# EasyEDA Pro project NUEVO board Rev. B.epro, schematic StepperDrive
Board Name: StepperDrive; Create Date: 2025-12-17; Page Name: P1; Project Name: 162 Carrier Board; Schematic Name: StepperDrive; Update Date: 2025-12-16; Company: EasyEDA.com; Page Size: A4; Version: V1.0
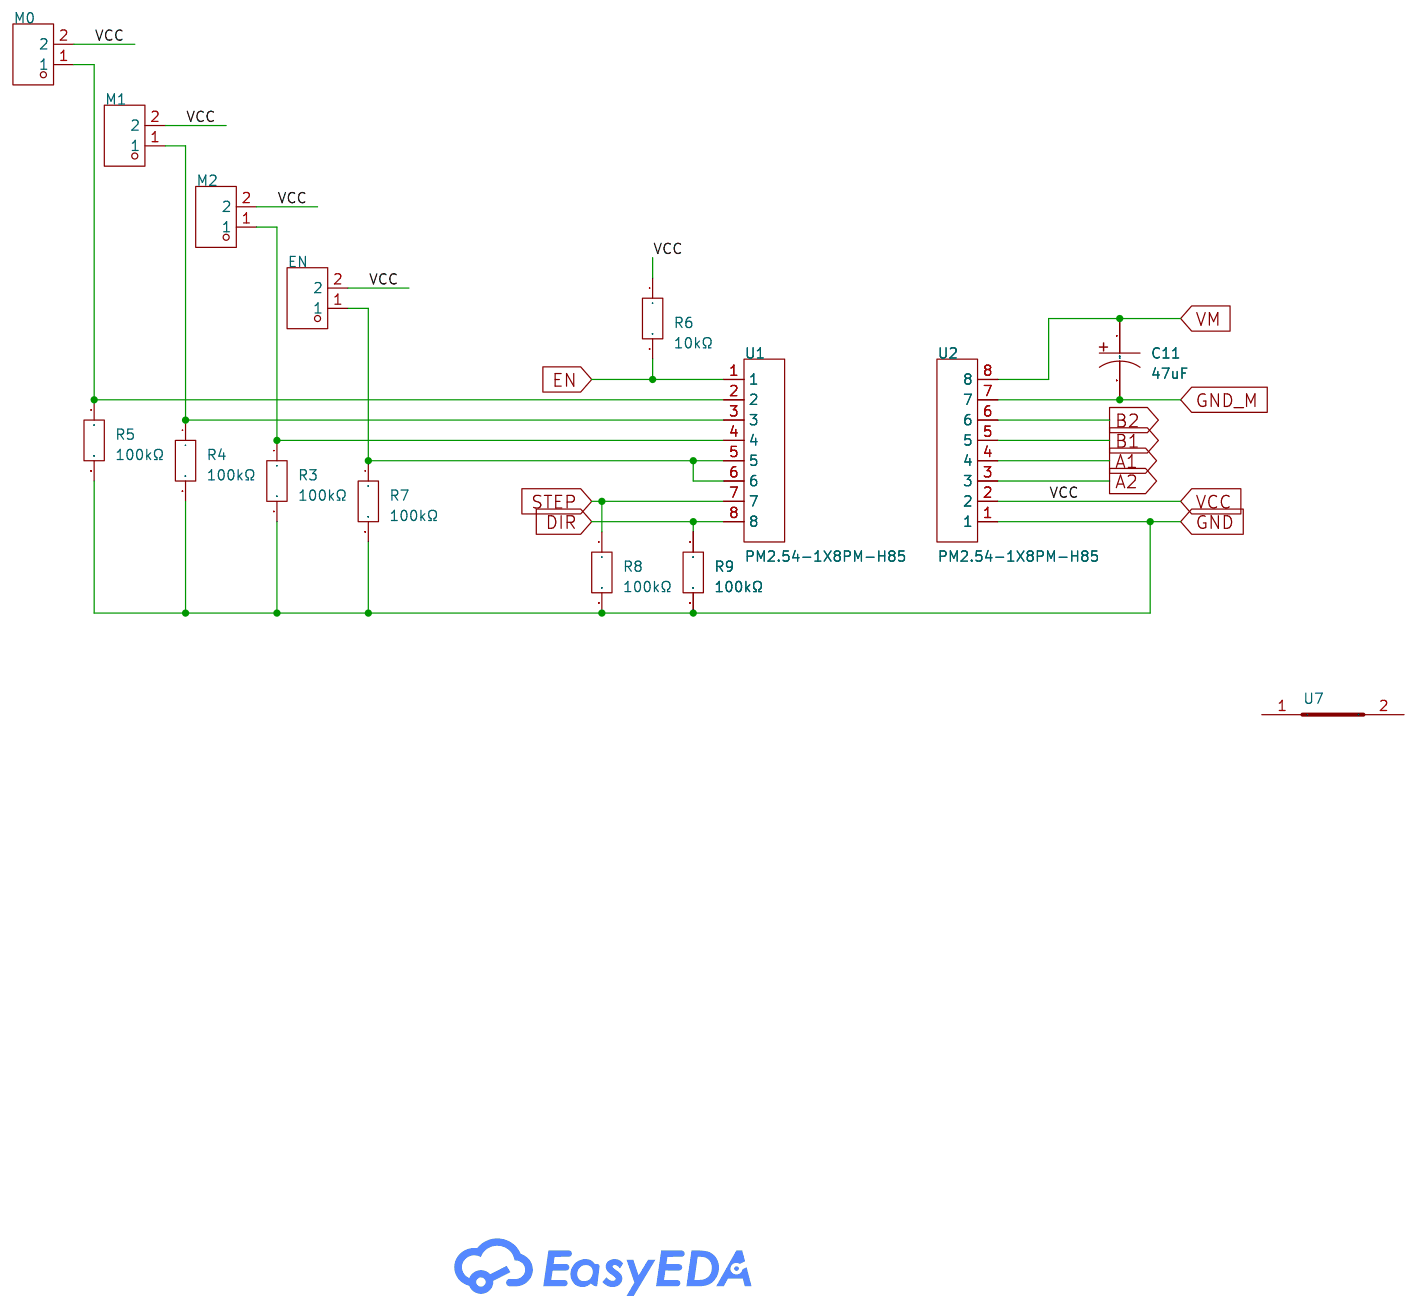
[diagram p5: schematic sheet]

## Parts
C11  47uF  [CAP-SMD_BD6.3-L6.6-W6.6-FD]
EN  HX PZ2.54-1x2P ZZ  [HDR-TH_2P-P2.54-V-M-3]
M0  HX PZ2.54-1x2P ZZ  [HDR-TH_2P-P2.54-V-M-3]
M1  HX PZ2.54-1x2P ZZ  [HDR-TH_2P-P2.54-V-M-3]
M2  HX PZ2.54-1x2P ZZ  [HDR-TH_2P-P2.54-V-M-3]
R3  100kΩ  [R0603]
R4  100kΩ  [R0603]
R5  100kΩ  [R0603]
R6  10kΩ  [R0402]
R7  100kΩ  [R0603]
R8  100kΩ  [R0603]
R9  100kΩ  [R0603]
U1  PM2.54-1X8PM-H85  [HDR-TH_8P-P2.54-V-F]
U2  PM2.54-1X8PM-H85  [HDR-TH_8P-P2.54-V-F]
U7  -  [short connect]

## Library data of the parts
C11 = 35SVPK47M: Capacitance:47uF Tolerance:±20% Tolerance:±20% Voltage Rating:35V Ripple Current:930mA@100kHz Equivalent Series Resistance(ESR):27mΩ@100kHz Type:Polymer Pin Spacing:- Diameter:6.3mm Height - Seated (Max):5.9mm Lifetime:1000hrs@125℃ Operating Temperature:-; LCSC Part Name: 47uF ±20% 35V; Supplier Part: C264034; Manufacturer: PANASONIC(松下); Supplier Footprint: SMD,D6.3xL5.9mm; Datasheet: https://item.szlcsc.com/datasheet/35SVPK47M/254791.html; Supplier: LCSC; Tolerance: ±20%; Voltage Rating: 35V; Ripple Current: 930mA@100kHz; Equivalent Series Resistance(ESR): 27mΩ@100kHz; Type: Polymer; Diameter: 6.3mm; Height - Seated (Max): 5.9mm; Lifetime: 1000hrs@125℃; Operating Temperature: -55℃~+125℃
EN M0-M2 = HX PZ2.54-1x2P ZZ: Pin Structure:1x2P Pitch:2.54mm Row Spacing:- Circluar Pins/Square Pins:Pin Header Mounting Type:Through Hole Number of Rows:1 Number of Pins:2P Current Rating:3A Voltage Rating (Max):1kV Length of Mating Pin:6mm Insulation Height:2.5mm Length of End Conn; LCSC Part Name: 1x2P 间距:2.54mm 方针 直插; Supplier Part: C32713268; Manufacturer: hanxia(韩下); Supplier Footprint: 插件,P=2.54mm; JLCPCB Part Class: Extended Part; Datasheet: https://item.szlcsc.com/datasheet/HX%2520PZ2.54-1x2P%2520ZZ/34444548.html; Supplier: LCSC; Pin Structure: 1x2P; Pitch: 2.54mm; Circluar Pins/Square Pins: Pin Header; Mounting Type: Through Hole; Number of Rows: 1; Number of Pins: 2P; Current Rating: 3A; Voltage Rating (Max): 1kV; Length of Mating Pin: 6mm; Insulation Height: 2.5mm; Length of End Connection Pin: 3mm; Contact Material: Brass; Contact Plating: Gold; Operating Temperature: -40℃~+105℃; Color: Black
R3-R5 R7-R9 = KTR03EZPF1003: Type:Thick Film Resistor Resistance:100kΩ Tolerance:±1% Tolerance:±1% Power(Watts):100mW Voltage-Supply(Max):350V Temperature Coefficient:±100ppm/℃ Temperature Coefficient:±100ppm/℃ Operating Temperature:-55℃~+155℃ Operating Temperature:-55℃~+155℃; LCSC Part Name: 厚膜电阻 100kΩ ±1% 100mW; Supplier Part: C510119; Manufacturer: ROHM(罗姆); Supplier Footprint: 0603; JLCPCB Part Class: Extended Part; Datasheet: https://item.szlcsc.com/datasheet/KTR03EZPF1003/523936.html; Supplier: LCSC; Type: Thick Film Resistor; Tolerance: ±1%; Power(Watts): 100mW; Voltage-Supply(Max): 350V; Temperature Coefficient: ±100ppm/℃; Operating Temperature: -55℃~+155℃
R6 = AC0402FR-1310KL: Type:Thick Film Resistor Resistance:10kΩ Tolerance:±1% Tolerance:±1% Power(Watts):63mW Temperature Coefficient:±100ppm/℃ Temperature Coefficient:±100ppm/℃ Operating Temperature:-55℃~+155℃ Operating Temperature:-55℃~+155℃; LCSC Part Name: 厚膜电阻 10kΩ ±1% 63mW; Supplier Part: C5455563; Manufacturer: YAGEO(国巨); Supplier Footprint: 0402; JLCPCB Part Class: Extended Part; Datasheet: https://atta.szlcsc.com/upload/public/pdf/source/20241120/4D446B3946E6DC27047BD586A1D384B4.pdf; Supplier: LCSC; Type: Thick Film Resistor; Tolerance: ±1%; Power(Watts): 63mW; Temperature Coefficient: ±100ppm/℃; Operating Temperature: -55℃~+155℃
U1 U2 = PM2.54-1X8PM-H85: Holes Structure:1x8P Pitch:2.54mm Row Spacing:- Circular Hole / Square Hole:Square Hole Mounting Type:Through Hole Number of Rows:1 Number of Positions:8P Current Rating:3A Voltage Rating (Max):- Holes Direction:Top Insulation Height:8.5mm Contact Materia; LCSC Part Name: 1x8P 间距:2.54mm 直插; Supplier Part: C42431840; Manufacturer: JXTCONN(聚兴泰); Supplier Footprint: 插件,P=2.54mm; JLCPCB Part Class: Extended Part; Datasheet: https://item.szlcsc.com/datasheet/PM2.54-1X8PM-H85/44458970.html; Supplier: LCSC; Holes Structure: 1x8P; Pitch: 2.54mm; Circular Hole / Square Hole: Square Hole; Mounting Type: Through Hole; Number of Rows: 1; Number of Positions: 8P; Current Rating: 3A; Holes Direction: Top; Insulation Height: 8.5mm; Contact Plating: Gold; Operating Temperature: -40℃~+105℃
U7 = short connect

## Nets
GND: R3.2 R4.2 R5.2 R7.2 R8.2 R9.2 U2.1
GND_M: C11.2 U2.7
VCC: EN.2 M0.2 M1.2 M2.2 R6.1 U2.2
A1: U2.4
A2: U2.3
B1: U2.5
B2: U2.6
DIR: R9.1 U1.8
EN: R6.2 U1.1
STEP: R8.1 U1.7
VM: C11.1 U2.8
$1N667: M1.1 R4.1 U1.3
$1N670: M0.1 R5.1 U1.2
$1N676: M2.1 R3.1 U1.4
Net-(EN-1): EN.1 R7.1 U1.5 U1.6

Not connected (* = marked no-connect by the designer): U7 1 2
